# EAGLE schematic test_schem (EAGLE 8.7.1)
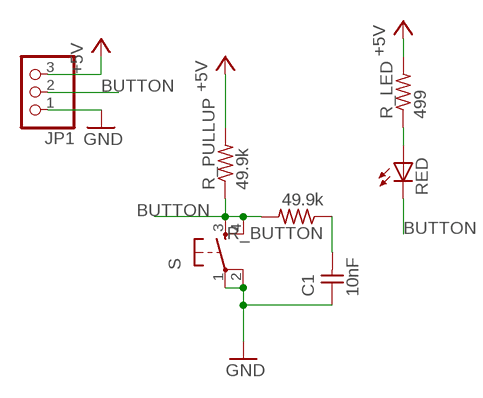
[diagram p0: schematic, sheet 1]

## Parts
C1  10nF  CAP-UNPOLARIZEDFAB  [C1206FAB]
JP1  PINHD-1X3  [1X03]
R_BUTTON  49.9k  RES-US1206FAB  [R1206FAB]
R_LED  499  RES-US1206FAB  [R1206FAB]
R_PULLUP  49.9k  RES-US1206FAB  [R1206FAB]
RED  LEDFAB1206  [LED1206FAB]
S  6MM_SWITCH6MM_SWITCH  [6MM_SWITCH]

## Nets
+5V: JP1.3 R_LED.2 R_PULLUP.2
BUTTON: JP1.2 R_BUTTON.2 R_PULLUP.1 RED.2(C) S.3(S) S.4(S1)
GND: C1.1 JP1.1 S.1(P) S.2(P1)
N$2: R_LED.1 RED.1(A)
N$4: C1.2 R_BUTTON.1

## Library data of the parts
C1 = fab:CAP-UNPOLARIZED
JP1 = pinhead:PINHD-1X3: PIN HEADER
R_BUTTON R_LED R_PULLUP = fab:RES-US: Resistor (US Symbol) Variants with postfix FAB are widened to allow the routing of internal traces
RED = fab:LED: LED
S = fab:6MM_SWITCH: OMRON SWITCH